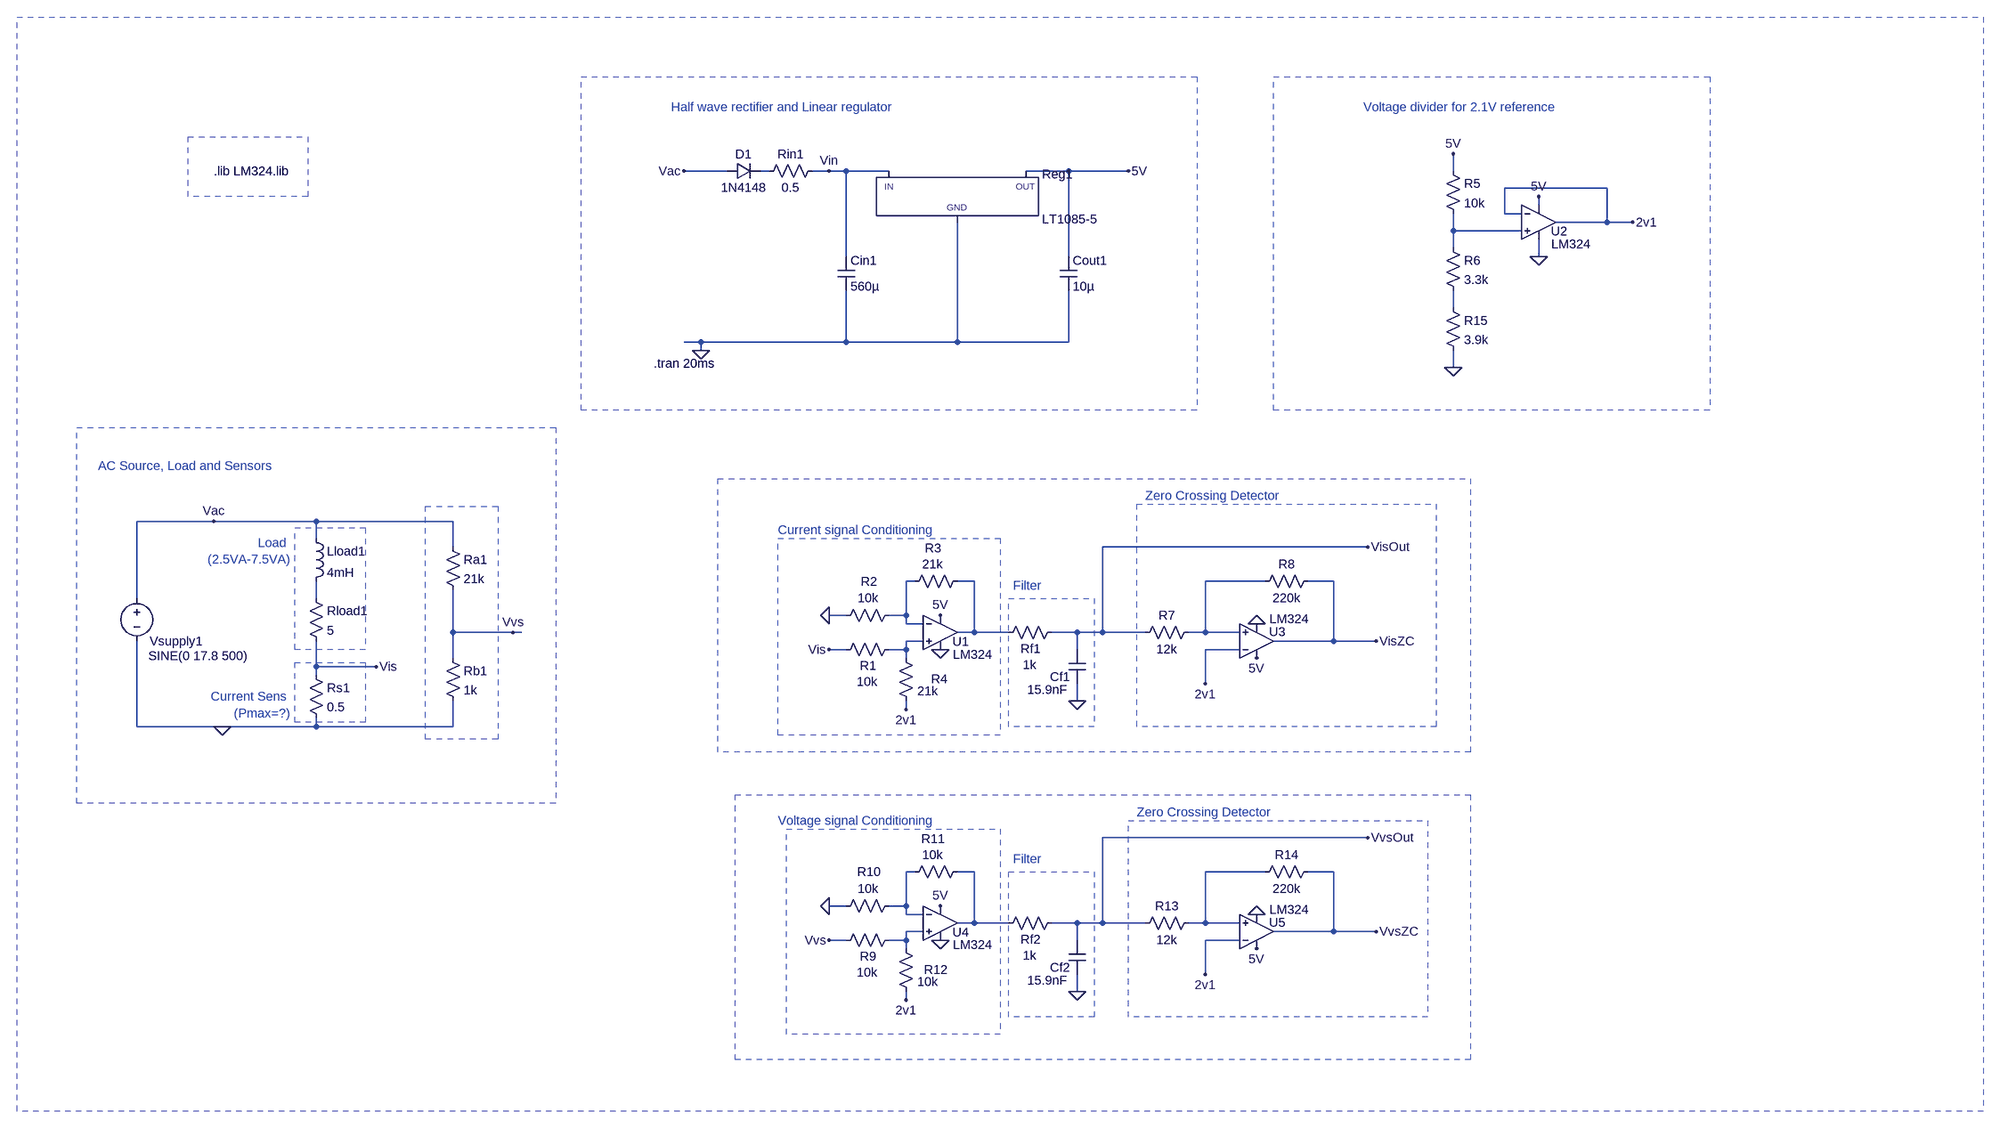
[diagram p0: schematic LTSPICEFINAL.asc]
LTSPICEFINAL.asc, the LTspice schematic file:
Version 4.1
SHEET 1 2036 1172
WIRE -320 -896 -400 -896
WIRE -240 -896 -256 -896
WIRE -128 -896 -160 -896
WIRE -96 -896 -128 -896
WIRE -16 -896 -96 -896
WIRE 320 -896 240 -896
WIRE 432 -896 320 -896
WIRE 1040 -896 1040 -928
WIRE 1328 -864 1136 -864
WIRE 1200 -832 1200 -848
WIRE 1136 -816 1136 -864
WIRE 1168 -816 1136 -816
WIRE 1328 -800 1328 -864
WIRE 1328 -800 1232 -800
WIRE 1376 -800 1328 -800
WIRE 1040 -784 1040 -816
WIRE 1168 -784 1040 -784
WIRE 1040 -752 1040 -784
WIRE -96 -736 -96 -896
WIRE 320 -736 320 -896
WIRE 1200 -736 1200 -768
WIRE 1040 -640 1040 -672
WIRE -368 -576 -400 -576
WIRE -96 -576 -96 -672
WIRE -96 -576 -368 -576
WIRE 112 -576 112 -800
WIRE 112 -576 -96 -576
WIRE 320 -576 320 -672
WIRE 320 -576 112 -576
WIRE -368 -560 -368 -576
WIRE 1040 -528 1040 -560
WIRE -1280 -240 -1424 -240
WIRE -1088 -240 -1280 -240
WIRE -832 -240 -1088 -240
WIRE -1088 -208 -1088 -240
WIRE -832 -192 -832 -240
WIRE 880 -192 384 -192
WIRE 32 -128 16 -128
WIRE 144 -128 112 -128
WIRE 688 -128 576 -128
WIRE 816 -128 768 -128
WIRE -1424 -96 -1424 -240
WIRE -1088 -96 -1088 -128
WIRE -96 -64 -128 -64
WIRE 16 -64 16 -128
WIRE 16 -64 -16 -64
WIRE 16 -48 16 -64
WIRE 48 -48 16 -48
WIRE -832 -32 -832 -112
WIRE -720 -32 -832 -32
WIRE -704 -32 -720 -32
WIRE 144 -32 144 -128
WIRE 144 -32 112 -32
WIRE 208 -32 144 -32
WIRE 336 -32 288 -32
WIRE 384 -32 384 -192
WIRE 384 -32 336 -32
WIRE 464 -32 384 -32
WIRE 576 -32 576 -128
WIRE 576 -32 544 -32
WIRE 640 -32 576 -32
WIRE 48 -16 16 -16
WIRE 816 -16 816 -128
WIRE 816 -16 704 -16
WIRE 896 -16 816 -16
WIRE -96 0 -128 0
WIRE 16 0 16 -16
WIRE 16 0 -16 0
WIRE 336 0 336 -32
WIRE 640 0 576 0
WIRE -832 16 -832 -32
WIRE 16 16 16 0
WIRE -1088 32 -1088 -16
WIRE -976 32 -1088 32
WIRE -1088 48 -1088 32
WIRE 576 64 576 0
WIRE 336 96 336 64
WIRE 16 112 16 96
WIRE -1424 144 -1424 -16
WIRE -1264 144 -1424 144
WIRE -1088 144 -1088 128
WIRE -1088 144 -1264 144
WIRE -832 144 -832 96
WIRE -832 144 -1088 144
WIRE 880 352 384 352
WIRE 32 416 16 416
WIRE 144 416 112 416
WIRE 688 416 576 416
WIRE 816 416 768 416
WIRE -96 480 -128 480
WIRE 16 480 16 416
WIRE 16 480 -16 480
WIRE 16 496 16 480
WIRE 48 496 16 496
WIRE 144 512 144 416
WIRE 144 512 112 512
WIRE 208 512 144 512
WIRE 336 512 288 512
WIRE 384 512 384 352
WIRE 384 512 336 512
WIRE 464 512 384 512
WIRE 576 512 576 416
WIRE 576 512 544 512
WIRE 640 512 576 512
WIRE 48 528 16 528
WIRE 816 528 816 416
WIRE 816 528 704 528
WIRE 896 528 816 528
WIRE -96 544 -128 544
WIRE 16 544 16 528
WIRE 16 544 -16 544
WIRE 336 544 336 512
WIRE 640 544 576 544
WIRE 16 560 16 544
WIRE 576 608 576 544
WIRE 336 640 336 608
WIRE 16 656 16 640
FLAG -368 -560 0
FLAG -400 -896 Vac
FLAG -128 -896 Vin
FLAG 432 -896 5V
FLAG -1264 144 0
FLAG -1280 -240 Vac
FLAG -720 -32 Vvs
FLAG -976 32 Vis
FLAG 80 0 0
FLAG 80 -64 5V
FLAG -128 0 Vis
FLAG -128 -64 0
FLAG 16 112 2v1
FLAG 336 96 0
FLAG 1040 -928 5V
FLAG 1376 -800 2v1
FLAG 1200 -848 5V
FLAG 1200 -736 0
FLAG 672 -48 0
FLAG 672 16 5V
FLAG 576 64 2v1
FLAG 880 -192 VisOut
FLAG 896 -16 VisZC
FLAG 80 544 0
FLAG 80 480 5V
FLAG -128 544 Vvs
FLAG -128 480 0
FLAG 16 656 2v1
FLAG 336 640 0
FLAG 672 496 0
FLAG 672 560 5V
FLAG 576 608 2v1
FLAG 880 352 VvsOut
FLAG 896 528 VvsZC
FLAG 1040 -528 0
DATAFLAG -96 -896 ""
SYMBOL PowerProducts/LT1085-5 112 -896 R0
SYMATTR InstName Reg1
SYMBOL res -144 -912 R90
WINDOW 0 0 56 VBottom 2
WINDOW 3 32 56 VTop 2
SYMATTR InstName Rin1
SYMATTR Value 0.5
SYMBOL diode -320 -880 R270
WINDOW 0 32 32 VTop 2
WINDOW 3 0 32 VBottom 2
SYMATTR InstName D1
SYMATTR Value 1N4148
SYMBOL cap -112 -736 R0
SYMATTR InstName Cin1
SYMATTR Value 560µ
SYMATTR SpiceLine Rser=0.001
SYMBOL cap 304 -736 R0
SYMATTR InstName Cout1
SYMATTR Value 10µ
SYMATTR SpiceLine Rser=0.001
SYMBOL voltage -1424 -112 R0
WINDOW 0 24 96 Left 2
WINDOW 3 22 124 Left 2
WINDOW 123 0 0 Left 0
WINDOW 39 0 0 Left 0
SYMATTR InstName Vsupply1
SYMATTR Value SINE(0 17.8 500)
SYMBOL res -1104 -112 R0
SYMATTR InstName Rload1
SYMATTR Value 5
SYMBOL ind -1104 -224 R0
SYMATTR InstName Lload1
SYMATTR Value 4mH
SYMBOL res -1104 32 R0
SYMATTR InstName Rs1
SYMATTR Value 0.5
SYMBOL res -848 -208 R0
SYMATTR InstName Ra1
SYMATTR Value 21k
SYMBOL res -848 0 R0
SYMATTR InstName Rb1
SYMATTR Value 1k
SYMBOL Opamps/opamp2 80 -96 R0
WINDOW 0 23 81 Left 2
WINDOW 3 24 105 Left 2
SYMATTR InstName U1
SYMATTR Value LM324
SYMBOL res 0 -16 R90
WINDOW 0 62 55 VBottom 2
WINDOW 3 61 57 VTop 2
SYMATTR InstName R1
SYMATTR Value 10k
SYMBOL res 0 -80 R90
WINDOW 0 -32 53 VBottom 2
WINDOW 3 -32 55 VTop 2
SYMATTR InstName R2
SYMATTR Value 10k
SYMBOL res 128 -144 R90
WINDOW 0 -30 61 VBottom 2
WINDOW 3 -31 62 VTop 2
SYMATTR InstName R3
SYMATTR Value 21k
SYMBOL res 32 112 R180
WINDOW 0 -62 57 Left 2
WINDOW 3 -44 34 Left 2
SYMATTR InstName R4
SYMATTR Value 21k
SYMBOL res 304 -48 R90
WINDOW 0 62 55 VBottom 2
WINDOW 3 61 57 VTop 2
SYMATTR InstName Rf1
SYMATTR Value 1k
SYMBOL cap 352 64 R180
WINDOW 0 29 13 Left 2
WINDOW 3 33 -11 Left 2
SYMATTR InstName Cf1
SYMATTR Value 15.9nF
SYMBOL res 1024 -912 R0
SYMATTR InstName R5
SYMATTR Value 10k
SYMBOL res 1024 -768 R0
SYMATTR InstName R6
SYMATTR Value 3.3k
SYMBOL Opamps/opamp2 1200 -864 R0
WINDOW 0 23 81 Left 2
WINDOW 3 24 105 Left 2
SYMATTR InstName U2
SYMATTR Value LM324
SYMBOL Opamps/opamp2 672 48 M180
WINDOW 0 23 81 Left 2
WINDOW 3 24 105 Left 2
SYMATTR InstName U3
SYMATTR Value LM324
SYMBOL res 560 -48 R90
WINDOW 0 0 56 VBottom 2
WINDOW 3 32 56 VTop 2
SYMATTR InstName R7
SYMATTR Value 12k
SYMBOL res 784 -144 R90
WINDOW 0 0 56 VBottom 2
WINDOW 3 32 56 VTop 2
SYMATTR InstName R8
SYMATTR Value 220k
SYMBOL Opamps/opamp2 80 448 R0
WINDOW 0 23 81 Left 2
WINDOW 3 24 105 Left 2
SYMATTR InstName U4
SYMATTR Value LM324
SYMBOL res 0 528 R90
WINDOW 0 62 55 VBottom 2
WINDOW 3 61 57 VTop 2
SYMATTR InstName R9
SYMATTR Value 10k
SYMBOL res 0 464 R90
WINDOW 0 -32 53 VBottom 2
WINDOW 3 -32 55 VTop 2
SYMATTR InstName R10
SYMATTR Value 10k
SYMBOL res 128 400 R90
WINDOW 0 -30 61 VBottom 2
WINDOW 3 -31 62 VTop 2
SYMATTR InstName R11
SYMATTR Value 10k
SYMBOL res 32 656 R180
WINDOW 0 -62 57 Left 2
WINDOW 3 -44 34 Left 2
SYMATTR InstName R12
SYMATTR Value 10k
SYMBOL res 304 496 R90
WINDOW 0 62 55 VBottom 2
WINDOW 3 61 57 VTop 2
SYMATTR InstName Rf2
SYMATTR Value 1k
SYMBOL cap 352 608 R180
WINDOW 0 29 13 Left 2
WINDOW 3 33 -11 Left 2
SYMATTR InstName Cf2
SYMATTR Value 15.9nF
SYMBOL Opamps/opamp2 672 592 M180
WINDOW 0 23 81 Left 2
WINDOW 3 24 105 Left 2
SYMATTR InstName U5
SYMATTR Value LM324
SYMBOL res 560 496 R90
WINDOW 0 0 56 VBottom 2
WINDOW 3 32 56 VTop 2
SYMATTR InstName R13
SYMATTR Value 12k
SYMBOL res 784 400 R90
WINDOW 0 0 56 VBottom 2
WINDOW 3 32 56 VTop 2
SYMATTR InstName R14
SYMATTR Value 220k
SYMBOL res 1024 -656 R0
SYMATTR InstName R15
SYMATTR Value 3.9k
TEXT -424 -1016 Left 2 ;Half wave rectifier and Linear regulator
TEXT -456 -536 Left 2 !.tran 20ms
TEXT -1496 -344 Left 2 ;AC Source, Load and Sensors
TEXT -1136 -200 Right 2 ;Load \n(2.5VA-7.5VA)
TEXT -1136 88 Right 2 ;Current Sens \n(Pmax=?)
TEXT -224 -224 Left 2 ;Current signal Conditioning
TEXT 872 -1016 Left 2 ;Voltage divider for 2.1V reference
TEXT -224 320 Left 2 ;Voltage signal Conditioning
TEXT -1280 -896 Left 2 !.lib LM324.lib
TEXT 216 -120 Left 2 ;Filter
TEXT 216 392 Left 2 ;Filter
TEXT 464 -288 Left 2 ;Zero Crossing Detector
TEXT 448 304 Left 2 ;Zero Crossing Detector
RECTANGLE Normal -884 -268 -748 168 2
RECTANGLE Normal -1128 -228 -996 0 2
RECTANGLE Normal -1128 24 -996 136 2
RECTANGLE Normal 2032 864 -1648 -1184 2
RECTANGLE Normal -640 288 -1536 -416 2
RECTANGLE Normal 1072 768 -304 272 2
RECTANGLE Normal 1072 192 -336 -320 2
RECTANGLE Normal 560 -448 -592 -1072 2
RECTANGLE Normal 1520 -448 704 -1072 2
RECTANGLE Normal 192 160 -224 -208 2
RECTANGLE Normal 368 144 208 -96 2
RECTANGLE Normal 192 720 -208 336 2
RECTANGLE Normal 368 688 208 416 2
RECTANGLE Normal 992 688 432 320 2
RECTANGLE Normal 1008 144 448 -272 2
RECTANGLE Normal -1104 -848 -1328 -960 2

The netlist it stands for:
* LTSPICEFINAL.asc
X§Reg1 0 5V Vin LT1085-5  ; pins GND OUT IN
Rin1 Vin N001 0.5
D1 Vac N001 1N4148
Cin1 Vin 0 560µ Rser=0.001
Cout1 5V 0 10µ Rser=0.001
Vsupply1 Vac 0 SINE(0 17.8 500)
Rload1 N007 Vis 5
Lload1 Vac N007 4mH
Rs1 Vis 0 0.5
Ra1 Vac Vvs 21k
Rb1 Vvs 0 1k
X§U1 N008 N004 5V 0 N005 LM324  ; pins In+ In- V+ V- OUT
R1 N008 Vis 10k
R2 N004 0 10k
R3 N005 N004 21k
R4 2v1 N008 21k
Rf1 VisOut N005 1k
Cf1 0 VisOut 15.9nF
R5 5V N002 10k
R6 N002 N003 3.3k
X§U2 N002 2v1 5V 0 2v1 LM324  ; pins In+ In- V+ V- OUT
X§U3 N006 2v1 5V 0 VisZC LM324  ; pins In+ In- V+ V- OUT
R7 N006 VisOut 12k
R8 VisZC N006 220k
X§U4 N012 N009 5V 0 N010 LM324  ; pins In+ In- V+ V- OUT
R9 N012 Vvs 10k
R10 N009 0 10k
R11 N010 N009 10k
R12 2v1 N012 10k
Rf2 VvsOut N010 1k
Cf2 0 VvsOut 15.9nF
X§U5 N011 2v1 5V 0 VvsZC LM324  ; pins In+ In- V+ V- OUT
R13 N011 VvsOut 12k
R14 VvsZC N011 220k
R15 N003 0 3.9k
.model D D
.lib standard.dio
* Half wave rectifier and Linear regulator
.tran 20ms
* AC Source, Load and Sensors
* Load
* (2.5VA-7.5VA)
* Current Sens
* (Pmax=?)
* Current signal Conditioning
* Voltage divider for 2.1V reference
* Voltage signal Conditioning
.lib LM324.lib
* Filter
* Filter
* Zero Crossing Detector
* Zero Crossing Detector
.backanno
.end